# EAGLE design wssf_arduino_nano_client (EAGLE 9.6.2)
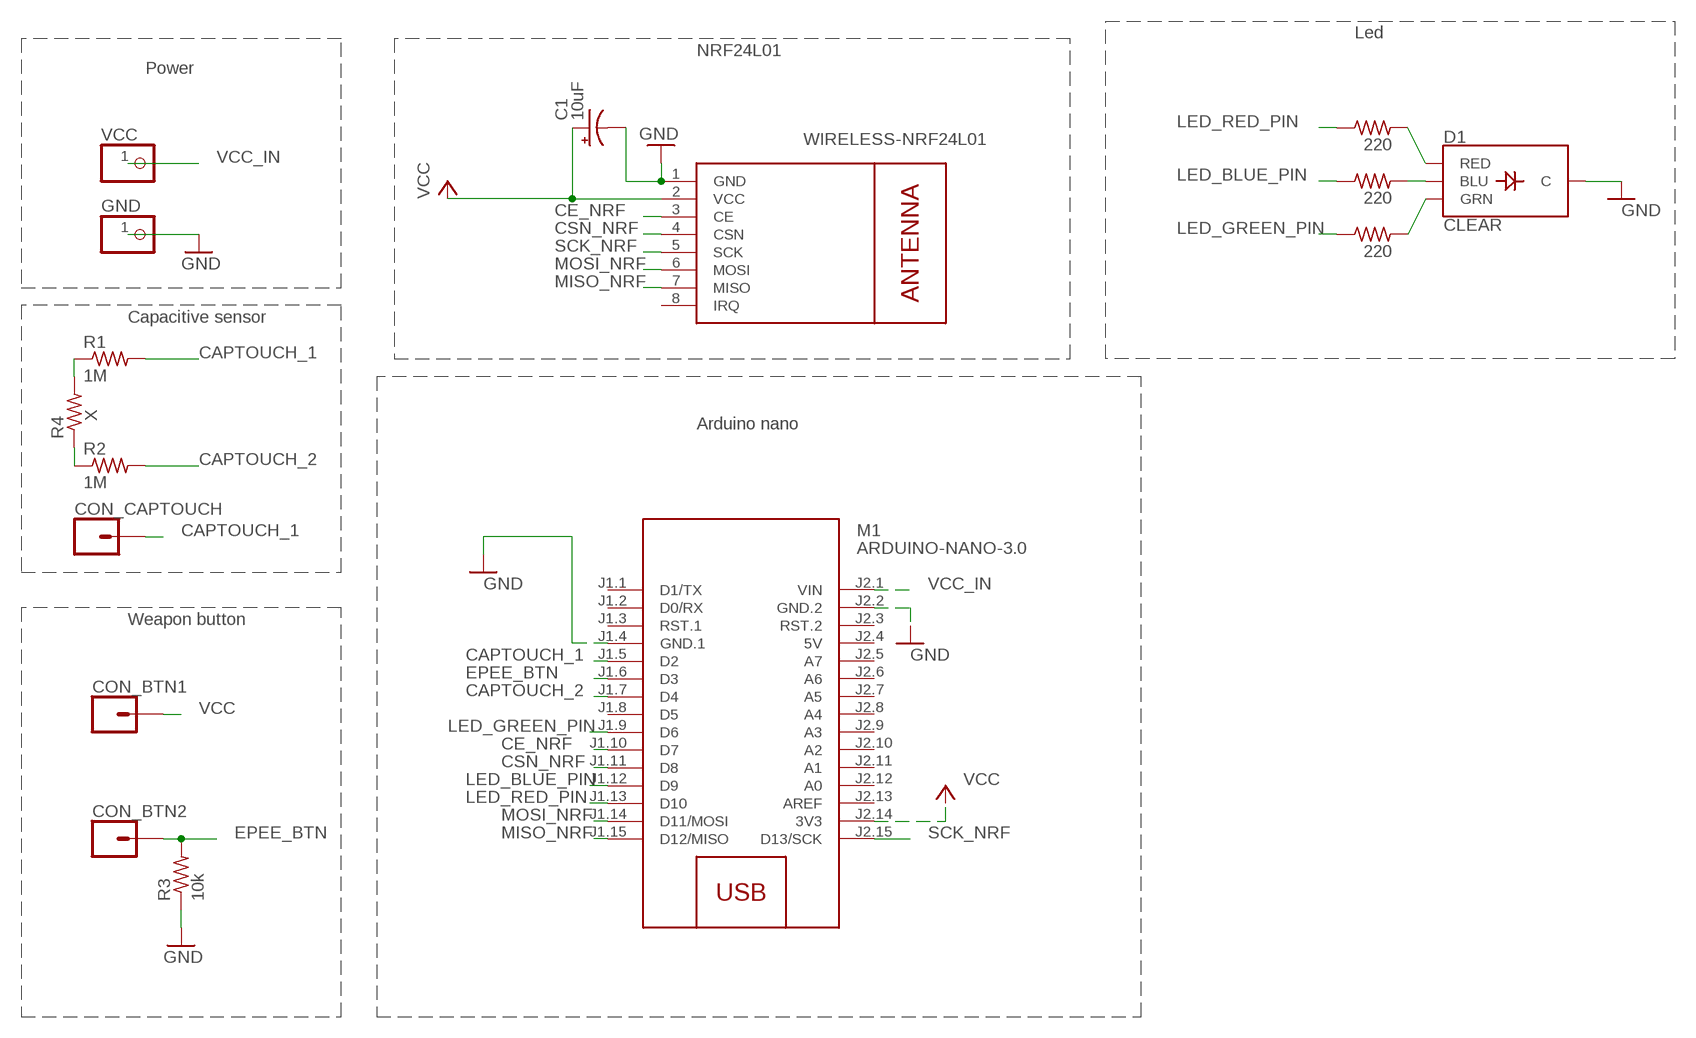
[diagram p0: schematic, sheet 1]

## Parts
C1  10uF  CPOL-USE2-5  [E2-5]
CON_BTN1  CONN_01  [1X01]
CON_BTN2  CONN_01  [1X01]
CON_CAPTOUCH  CONN_01  [1X01]
D1  CLEAR  LED-RGB-CCCLEAR  [LED-RGB-THRU]
GND  PINHD-1X1  [1X01]
M1  ARDUINO-NANO-3.0  [ARDUINO-NANO-3.0]
M2  WIRELESS-NRF24L01  [WIRELESS-NRF24L01]
R1  1M  R-US_0204/7  [0204/7]
R2  1M  R-US_0204/7  [0204/7]
R3  10k  R-US_0204/7  [0204/7]
R4  X  R-US_0204/7  [0204/7]
R_LED1  220  R-US_0204/7  [0204/7]
R_LED2  220  R-US_0204/7  [0204/7]
R_LED3  220  R-US_0204/7  [0204/7]
VCC  PINHD-1X1  [1X01]

## Nets
CAPTOUCH_1: CON_CAPTOUCH.1 M1.J1.5(D2) R1.2
CAPTOUCH_2: M1.J1.7(D4) R2.2
CE_NRF: M1.J1.10(D7) M2.3(CE)
CSN_NRF: M1.J1.11(D8) M2.4(CSN)
EPEE_BTN: CON_BTN2.1 M1.J1.6(D3) R3.2
GND: C1.- D1.2(C) GND.1 M1.J1.4(GND.1) M1.J2.2(GND.2) M2.1(GND) R3.1
LED_BLUE_PIN: M1.J1.12(D9) R_LED2.1
LED_GREEN_PIN: M1.J1.9(D6) R_LED3.1
LED_RED_PIN: M1.J1.13(D10) R_LED1.1
MISO_NRF: M1.J1.15(D12/MISO) M2.7(MISO)
MOSI_NRF: M1.J1.14(D11/MOSI) M2.6(MOSI)
N$1: R1.1 R4.2
N$2: D1.1(RED) R_LED1.2
N$3: R2.1 R4.1
N$4: D1.4(BLU) R_LED2.2
N$5: D1.3(GRN) R_LED3.2
SCK_NRF: M1.J2.15(D13/SCK) M2.5(SCK)
VCC: C1.+ CON_BTN1.1 M1.J2.14(3V3) M2.2(VCC)
VCC_IN: M1.J2.1(VIN) VCC.1
Unconnected: M1.J1.1(D1/TX) M1.J1.2(D0/RX) M1.J1.3(RST.1) M1.J1.8(D5) M1.J2.3(RST.2) M1.J2.5(A7) M1.J2.6(A6) M1.J2.7(A5) M1.J2.8(A4) M1.J2.9(A3) M1.J2.10(A2) M1.J2.11(A1) M1.J2.12(A0) M1.J2.13(AREF) M2.8(IRQ)

## Notes on the sheet
- Led
- NRF24L01
- Power
- Capacitive sensor
- Arduino nano
- Weapon button

## Power pins joined to a net without a drawn wire
5V: M1.J2.4(5V)

## Library data of the parts
C1 = rcl:CPOL-US: POLARIZED CAPACITOR, American symbol; SPICEPREFIX: C
CON_BTN1 CON_BTN2 CON_CAPTOUCH = SparkFun-Connectors:CONN_01: Single connection point. Often used as Generic Header-pin footprint for 0.1 inch spaced/style header connections On any of the 0.1 inch spaced packages, you can populate with these: Break Away Headers - Straight <https://www.sparkfun.com/products/116> (PRT-00116) Break Away Male Headers - Right Angle <https://www.sparkfun.com/products/553> (PRT-00553) Female Headers <https://www.sparkfun.com/products/115> (PRT-00115) Break Away Headers - Machine Pin <https://www.sparkfun.com/products/117> (PRT-00117) Break Away Female Headers - Swiss Machine Pin <https://www.sparkfun.com/products/743> (PRT-00743) This device is also useful as a general connection point to wire up your design to another part of your project. Our various solder wires solder well into these plated through hole pads. Hook-Up Wire - Assortment (Stranded, 22 AWG) <https://www.sparkfun.com/products/11375> (PRT-11375) Hook-Up Wire - Assortment (Solid Core, 22 AWG) <https://www.sparkfun.com/products/11367> (PRT-11367) View the entire wire category on our website here <https://www.sparkfun.com/categories/141> Special notes: SMTSO-256-ET is a "flush mount" nut for a 4-40 screw. We mostly use this on specialty testbeds; it is a nice way to connect hardware to your PCB at an adjustable hieght. Also note, the SNAP packages are for using a snappable style connector. We sell a baggie of snaps and they are also used on two LilyPad designs: Snap Assortment - 30 pack (male and female) <https://www.sparkfun.com/products/11347> (DEV-11347) LilyPad Arduino SimpleSnap <https://www.sparkfun.com/products/10941> (DEV-10941) LilyPad SimpleSnap Protoboard <https://www.sparkfun.com/products/10940> (DEV-10940)
D1 = SparkFun-LED:LED-RGB-CC: LED-RGB Common Cathode Packages: LED RGB-THRU LED_PIRANHA_5MM SparkFun Products: RGB Diffused Common Cathode- Diffuse <[https://www.sparkfun.com/products/9264]> RGB Diffused Common Cathode - Clear <[https://www.sparkfun.com/products/105]> LED-RGB 5mm Square (Piranha) <[https://www.sparkfun.com/products/11679]>; PROD_ID: DIO-08418
GND VCC = pinhead:PINHD-1X1: PIN HEADER
M1 = wsff_lib:ARDUINO-NANO-3.0: Arduino Nano 3.0 and compatible devices More details available here: https://www.arduino.cc/en/Main/ArduinoBoardNano Click here to find device on ebay.com <http://www.ebay.com/sch/arduino+nano>
M2 = wsff_lib:WIRELESS-NRF24L01: 2.4 GHz Wireless Module based on NRF24L01 chip More details available here: http://www.electrodragon.com/w/NRF24L01 Click here to find device on ebay.com <http://www.ebay.com/sch/nrf24l01+arduino>
R1-R4 R_LED1-R_LED3 = rcl:R-US_: RESISTOR, American symbol; SPICEPREFIX: R

## Board
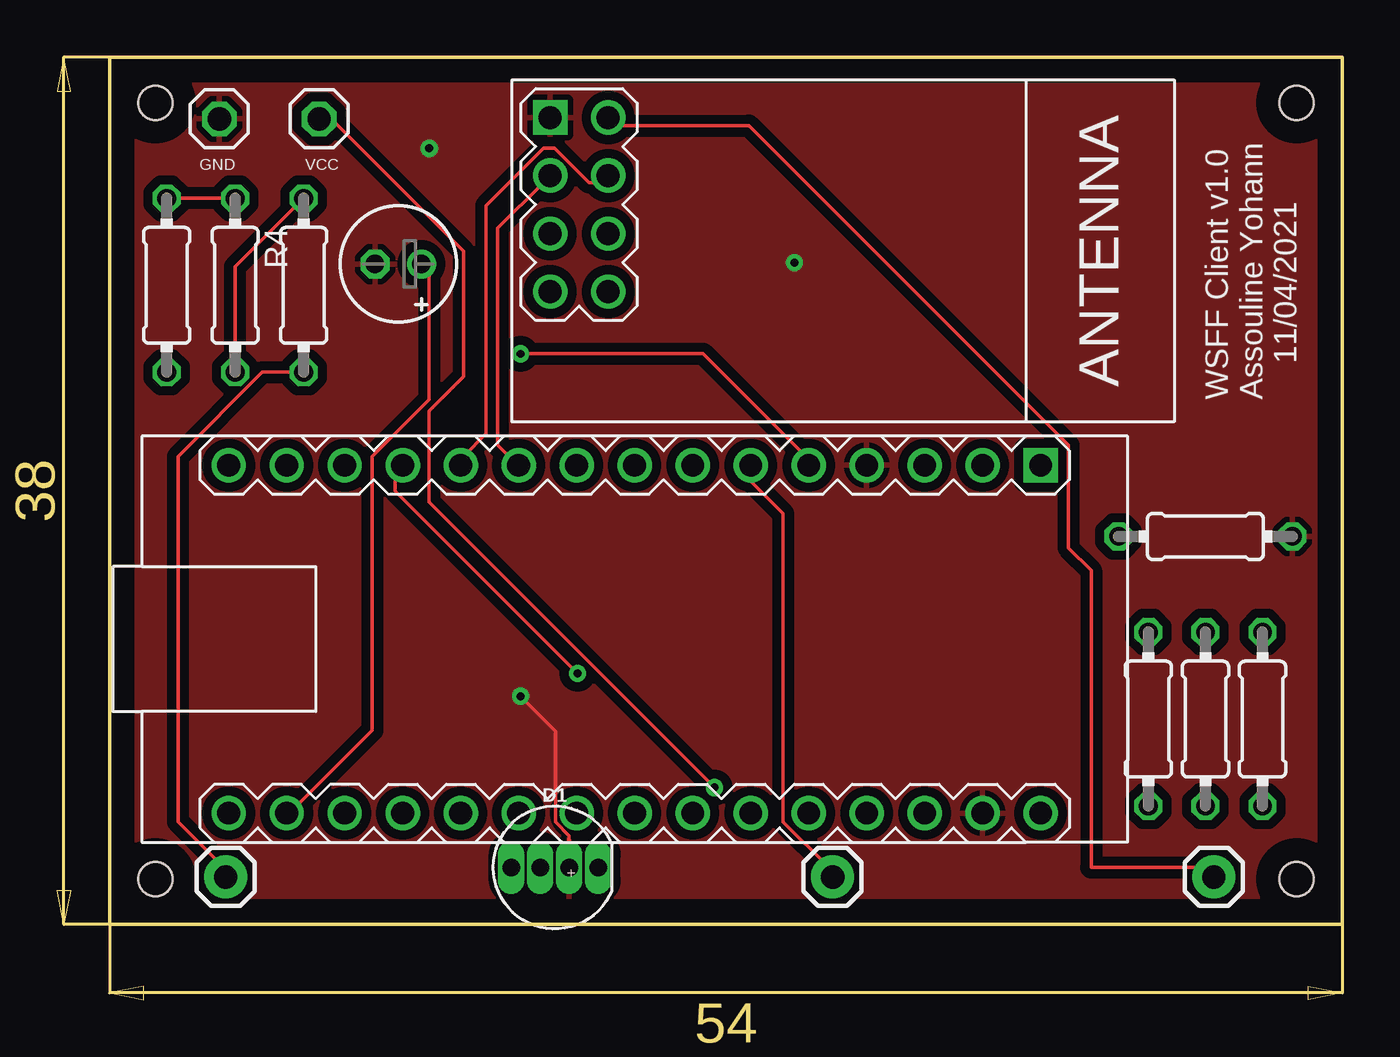
[diagram p1: board, top side]
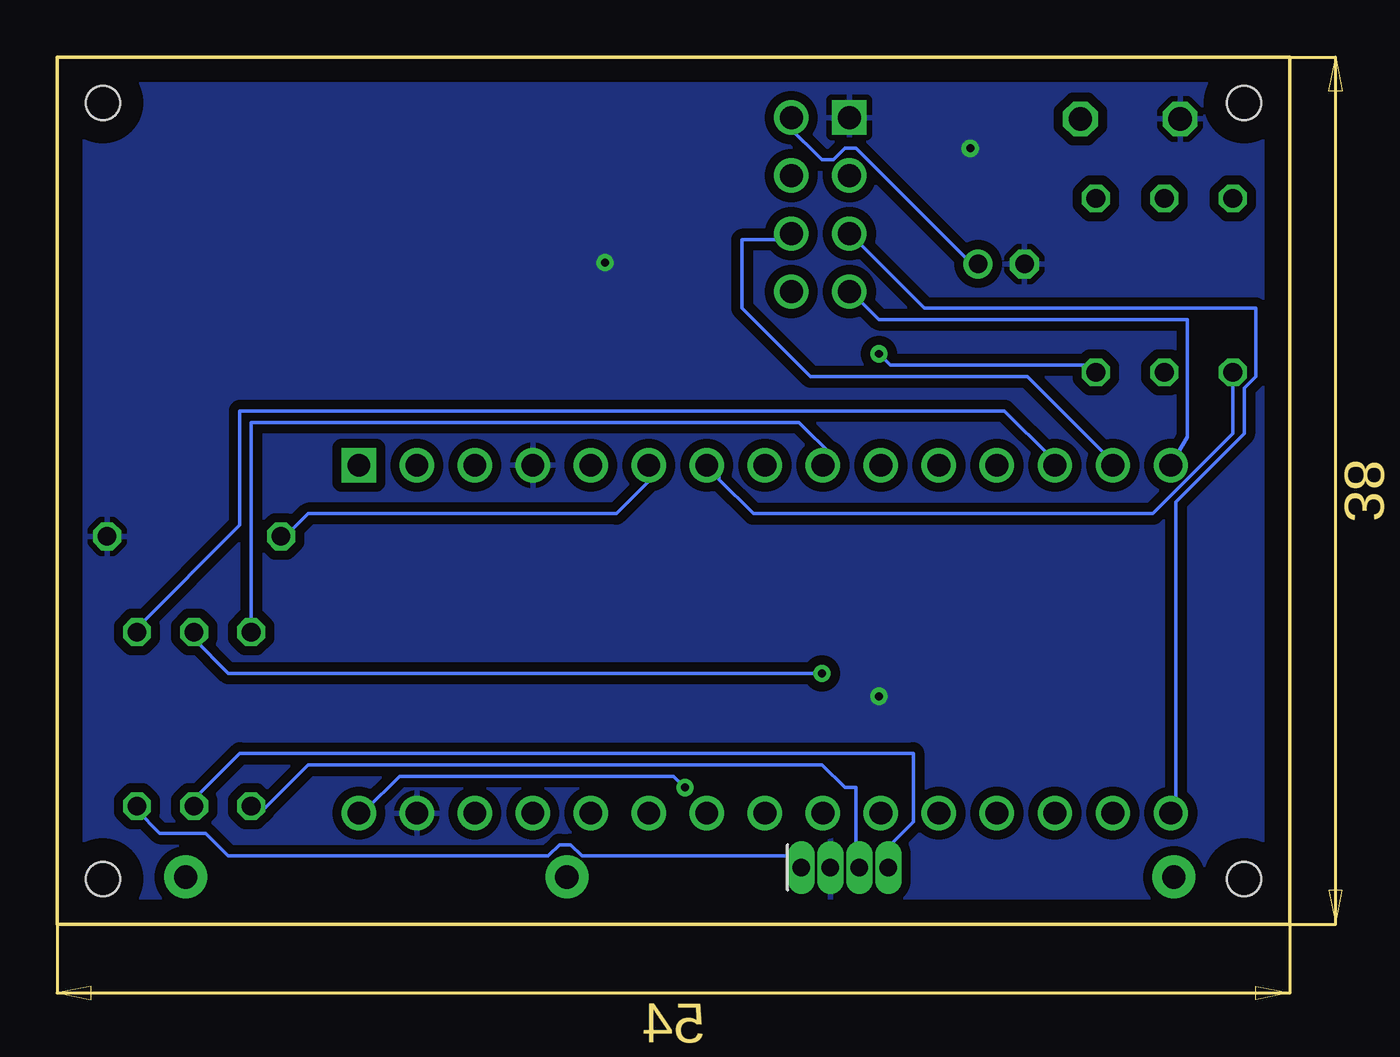
[diagram p2: board, bottom side, seen from below]

Size 54 x 38 mm. Coordinates in mm from the lower left corner, seen from the top.
Outline: 0,0 0,38 54,38 54,0 0,0
Copper layers (1*16): Top 0.035mm / dielectric 1.5mm / Bottom 0.035mm
Design rules "default *": minimum track width 6mil, minimum drill 0.35mm, track to track 6mil, track to pad 4mil, pad to pad 4mil, via to via 6mil, smd to smd 6mil, copper to edge 40mil, drill to drill 6mil, minimum pad ring 8mil, minimum via ring 8mil, stop-mask expansion 4mil, vias tented up to drill 0mil, thermal gap 10mil
Holes 1.5 mm at 52,36 2,2 2,36 52,2

### Footprints (pad centres in the part's own frame; a part is rotated, then mirrored left to right if it is on the bottom)
E2-5 = drill 0.813 pad 1.27: + -1.016,0 | drill 0.813 pad 1.27 octagon: - 1.016,0
1X01 = drill 1.016 pad 1.88: 1 0,0
LED-RGB-THRU = drill 0.762 pad 0.889 long: 1 1.905,0; 2 0.635,0; 3 -0.635,0; 4 -1.905,0
1X01' = drill 1.016 octagon: 1 0,0
ARDUINO-NANO-3.0 = drill 1 square: J1.1 17.78,7.62 | drill 1: J1.2 15.24,7.62; J1.3 12.7,7.62; J1.4 10.16,7.62; J1.5 7.62,7.62; J1.6 5.08,7.62; J1.7 2.54,7.62; J1.8 0,7.62; J1.9 -2.54,7.62; J1.10 -5.08,7.62; J1.11 -7.62,7.62; J1.12 -10.16,7.62; J1.13 -12.7,7.62; J1.14 -15.24,7.62; J1.15 -17.78,7.62; J2.1 17.78,-7.62; J2.2 15.24,-7.62; J2.3 12.7,-7.62; J2.4 10.16,-7.62; J2.5 7.62,-7.62; J2.6 5.08,-7.62; J2.7 2.54,-7.62; J2.8 0,-7.62; J2.9 -2.54,-7.62; J2.10 -5.08,-7.62; J2.11 -7.62,-7.62; J2.12 -10.16,-7.62; J2.13 -12.7,-7.62; J2.14 -15.24,-7.62; J2.15 -17.78,-7.62
WIRELESS-NRF24L01 = drill 1 square: 1 -12.7,6.35 | drill 1: 2 -10.16,6.35; 3 -12.7,3.81; 4 -10.16,3.81; 5 -12.7,1.27; 6 -10.16,1.27; 7 -12.7,-1.27; 8 -10.16,-1.27
0204/7 = drill 0.813 octagon: 1 -3.81,0; 2 3.81,0

### Placement (x,y rotation side)
C1  12.64,28.94 180 top
CON_BTN1  48.37,2.08 0 top
CON_BTN2  31.67,2.08 0 top
CON_CAPTOUCH  5.08,2.08 0 top
D1  19.5,2.5 0 top
GND  [1X01']  4.81,35.29 0 top
M1  23,12.5 0 top
M2  32,29 0 top
R1  8.5,28 270 top
R2  2.5,28 270 top
R3  48,17 180 top
R4  5.5,28 270 top
R_LED1  50.5,9 270 top
R_LED2  48,9 270 top
R_LED3  45.5,9 270 top
VCC  [1X01']  9.18,35.29 0 top

### Tracks (layer width: path | path; a pad name or v marks a point on that pad's centre or on a via)
CAPTOUCH_1  (via drill 0.35)
  Top 0.152: R1.2 6.69,24.19 3,20.5 3,4.5 5,2.5 CON_CAPTOUCH.1 | v18,25 26,25 30.5,20.5 M1.J1.5
  Bottom 0.152: v18,25 17.5,24.5 8.5,24.5 R1.2
CAPTOUCH_2
  Bottom 0.152: R2.2 2.5,21.5 6,18 23.5,18 25,19.5 25,20 25.5,20 M1.J1.7
CE_NRF
  Top 0.152: M1.J1.10 17.5,20.5 17,21 17,30.5 19,32.5 M2.3
CSN_NRF
  Top 0.152: M1.J1.11 15.5,20.5 16.5,21.5 16.5,31.5 19,34 19.5,34 21,32.5 21.5,32.5 M2.4
EPEE_BTN
  Top 0.152: CON_BTN2.1 31.5,2.5 29.5,4.5 29.5,18 28,19.5 28,20 M1.J1.6
  Bottom 0.152: R3.2 44,17 43,18 29.5,18 28,19.5 28,20 M1.J1.6
GND  (via drill 0.35)
  Top 0.152: D1.2 20.14,3.89 19.53,4.5 19.53,8.47 v18,10
  other vias: 30,29 14,34
  pour Bottom (isolate 0.406): 0,0 0,38 54,38 54,0
  pour Top (isolate 0.406): 0,0 0,38 54,38 54,0
LED_BLUE_PIN  (via drill 0.35)
  Top 0.152: v20.5,11 12.5,19 12.5,20 M1.J1.12
  Bottom 0.152: v20.5,11 46.5,11 48,12.5 R_LED2.1
LED_GREEN_PIN
  Bottom 0.152: R_LED3.1 45.5,22 21.5,22 20,20.5 M1.J1.9
LED_RED_PIN
  Bottom 0.152: R_LED1.1 50.5,13 46,17.5 46,22.5 12.5,22.5 10.5,20.5 M1.J1.13
MISO_NRF
  Bottom 0.152: M1.J1.15 4.5,21.36 4.5,26.5 18,26.5 19,27.5 M2.7
MOSI_NRF
  Bottom 0.152: M1.J1.14 8,20.5 11.5,24 21,24 24,27 24,30 22,30 M2.6
N$1
  Top 0.152: R4.2 5.5,28.81 R1.1
N$2
  Bottom 0.152: D1.1 21.5,2.5 22,3 31,3 31.5,3.5 32,3.5 32.5,3 46.5,3 47.5,4 49.5,4 50.5,5 R_LED1.2
N$3
  Top 0.152: R4.1 R2.1
N$4
  Bottom 0.152: D1.4 17.5,2.5 17.5,3.5 16.5,4.5 16.5,7.5 46,7.5 48,5.5 R_LED2.2
N$5
  Bottom 0.152: D1.3 19,2.5 19,6 19.5,6 20.5,7 43,7 45,5 45.5,5 R_LED3.2
SCK_NRF
  Bottom 0.152: M1.J2.15 5,5 5,18.5 2,21.5 2,23.5 1.5,24 1.5,27 16,27 19,30 M2.5
VCC
  Top 0.152: M1.J2.14 8,5 11.5,8.5 11.5,20.5 14,23 14,28.5 C1.+ | CON_BTN1.1 48,2.5 43,2.5 43,15.5 42,16.5 42,21 28,35 22,35 M2.2
  Bottom 0.152: C1.+ 14,29 19,34 19.5,34 20,33.5 20.5,33.5 22,35 M2.2
VCC_IN  (via drill 0.35)
  Top 0.152: v26.5,6 14,18.5 14,22.5 15.5,24 15.5,29.5 9.5,35.5 VCC.1
  Bottom 0.152: v26.5,6 27,6.5 39,6.5 40.5,5 M1.J2.1

### Text on the board
tPlace: WSFF Client v1.0 / Assouline Yohann / 11/04/2021 | +